# EAGLE design skithSTMv2 (EAGLE 6.6.0)

## Sheet 1 of 2
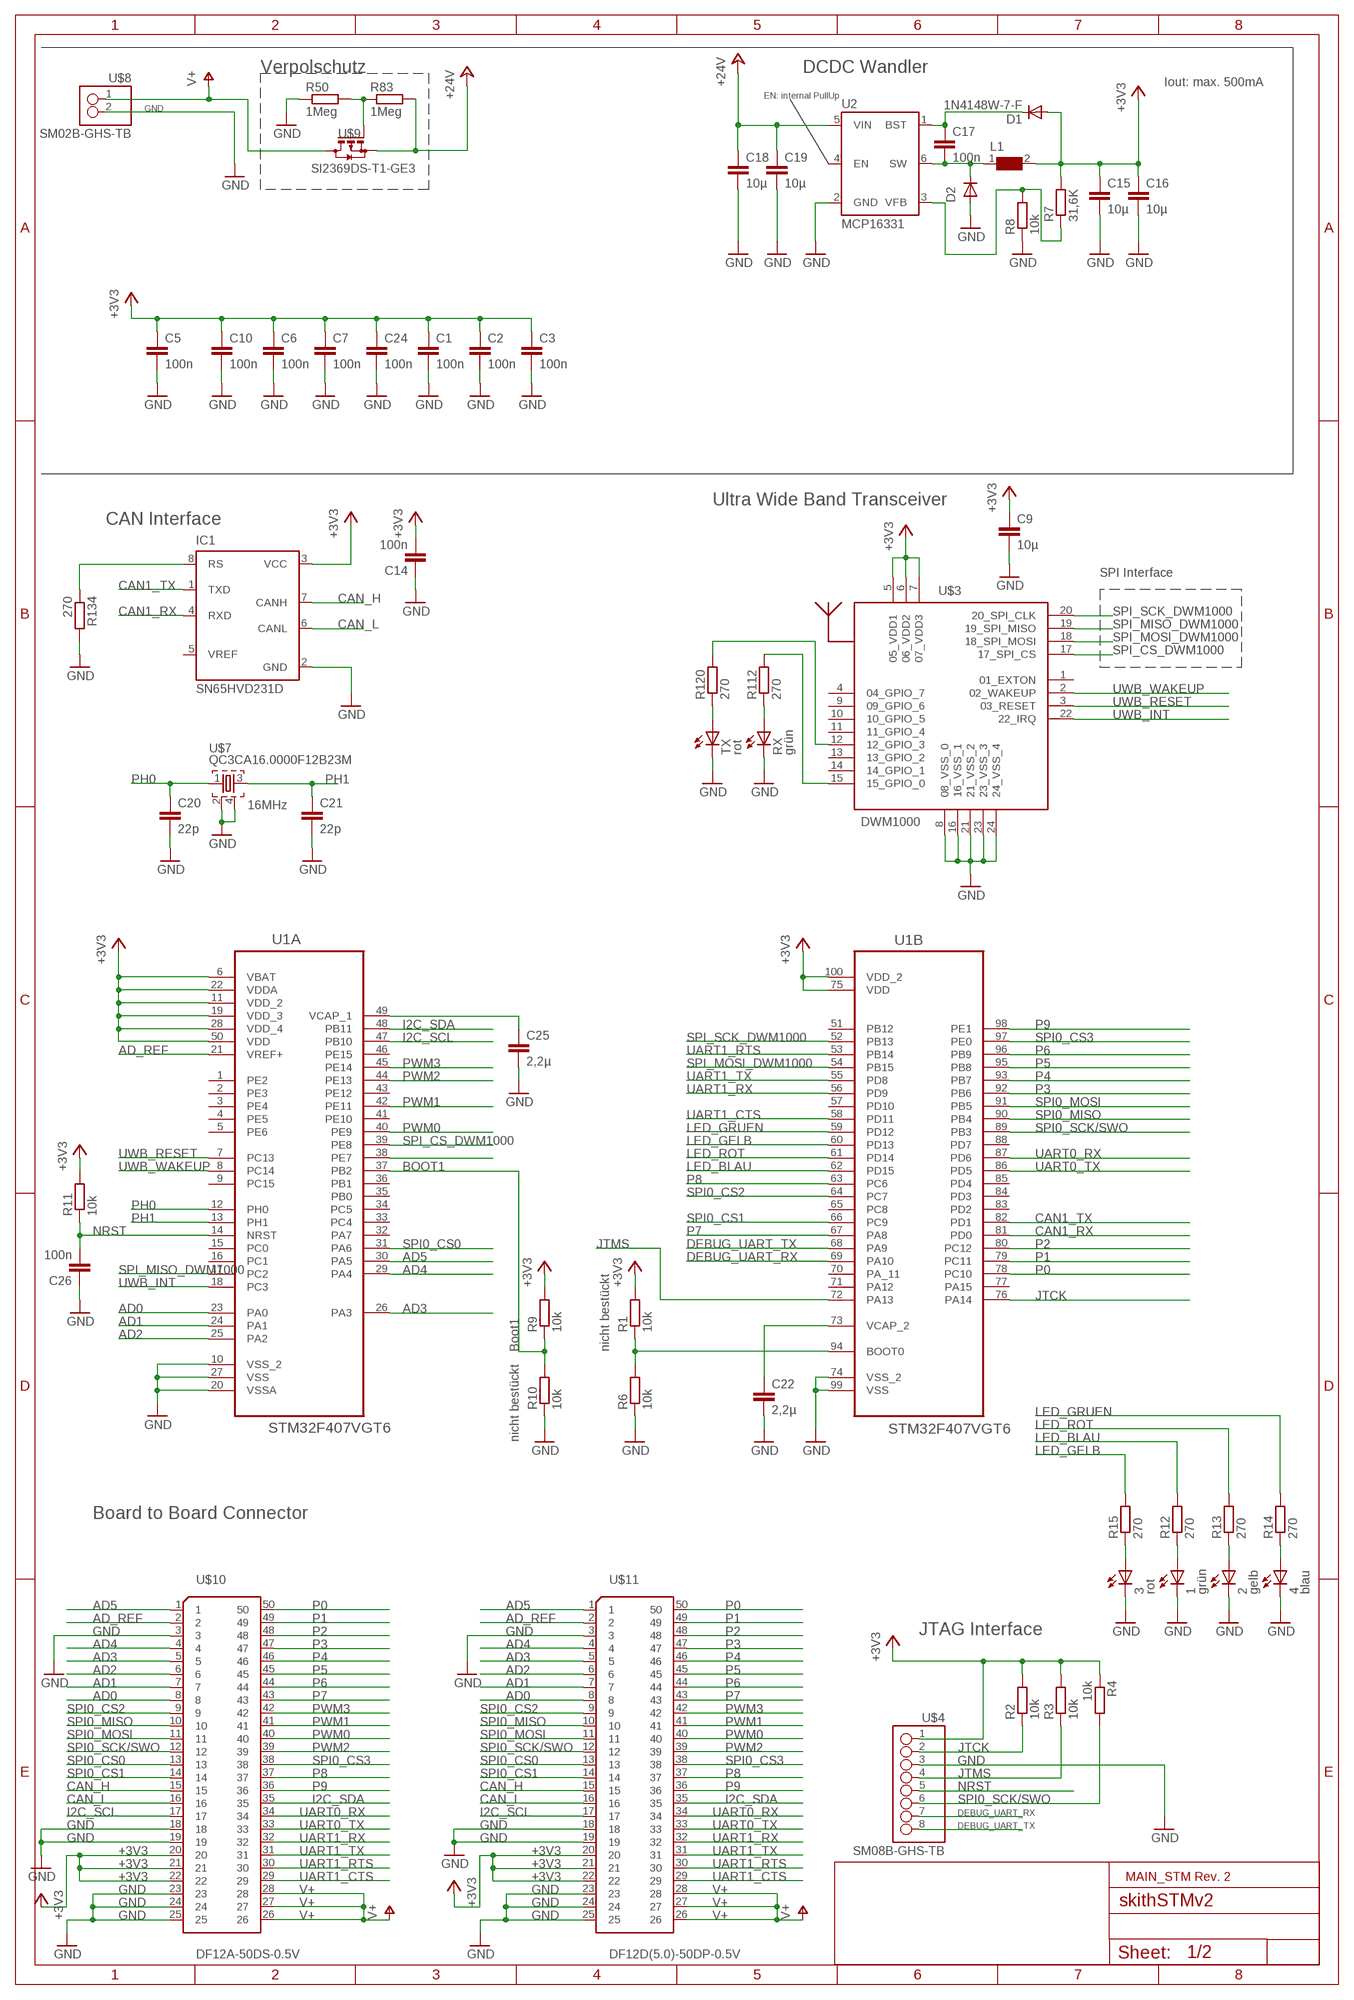
[diagram p0: schematic, sheet 1]

### Parts
1  grün  LEDSML0603  [SML0603]
2  gelb  LEDSML0603  [SML0603]
3  rot  LEDSML0603  [SML0603]
4  blau  LEDSML0603  [SML0603]
C1  100n  C-EUC0402  [C0402]
C2  100n  C-EUC0402  [C0402]
C3  100n  C-EUC0402  [C0402]
C5  100n  C-EUC0402  [C0402]
C6  100n  C-EUC0402  [C0402]
C7  100n  C-EUC0402  [C0402]
C9  10µ  C-EUC0805  [C0805]
C10  100n  C-EUC0402  [C0402]
C14  100n  C-EUC0402  [C0402]
C15  10µ  C-EUC0805  [C0805]
C16  10µ  C-EUC0805  [C0805]
C17  100n  C-EUC0402  [C0402]
C18  10µ  C-EUC0805  [C0805]
C19  10µ  C-EUC0805  [C0805]
C20  22p  C-EUC0402  [C0402]
C21  22p  C-EUC0402  [C0402]
C22  2,2µ  C-EUC0402  [C0402]
C24  100n  C-EUC0402  [C0402]
C25  2,2µ  C-EUC0402  [C0402]
C26  100n  C-EUC0402  [C0402]
D1  1N4148W-7-F  DIODE-SOD123  [SOD123]
D2  DIODE-DO214AC  [DO214AC]
IC1  SN65HVD231D  PCA82C250T  [SO8]
L1  WE-TPC-744025150_2828  [WE-TPC_2828]
R1  10k  R-EU_R0402  [R0402]
R2  10k  R-EU_R0402  [R0402]
R3  10k  R-EU_R0402  [R0402]
R4  10k  R-EU_R0402  [R0402]
R6  10k  R-EU_R0402  [R0402]
R7  31,6K  R-EU_R0402  [R0402]
R8  10k  R-EU_R0402  [R0402]
R9  10k  R-EU_R0402  [R0402]
R10  10k  R-EU_R0402  [R0402]
R11  10k  R-EU_R0402  [R0402]
R12  270  R-EU_R0402  [R0402]
R13  270  R-EU_R0402  [R0402]
R14  270  R-EU_R0402  [R0402]
R15  270  R-EU_R0402  [R0402]
R50  1Meg  R-EU_R0402  [R0402]
R83  1Meg  R-EU_R0402  [R0402]
R112  270  R-EU_R0402  [R0402]
R120  270  R-EU_R0402  [R0402]
R134  270  R-EU_R0402  [R0402]
RX  grün  LEDSML0603  [SML0603]
TX  rot  LEDSML0603  [SML0603]
U1  STM32F407VGT6  [QFP50P1600X1600X160-100N]
U2  MCP16331  [SOT23-6]
U$3  DWM1000  [DWM1000]
U$4  SM08B-GHS-TB  [SM08B-GHS-TB]
U$7  QC3CA16.0000F12B23M  QC3CA12.0000F12B23M  [LFXTAL055998]
U$8  SM02B-GHS-TB  [SM02B-GHS-TB]
U$9  SI2369DS-T1-GE3  [SOT23]
U$10  DF12A-50DS-0.5V  [DF12A-50DS-0.5V]
U$11  DF12D(5.0)-50DP-0.5V  [DF12D(5.0)-50DP-0.5V]

### Nets
+3V3: C1.1 C2.1 C3.1 C5.1 C6.1 C7.1 C9.1 C10.1 C14.2 C15.1 C16.1 C24.1 D1.A IC1.3(VCC) L1.2 R1.2 R2.2 R3.2 R4.1 R7.2 R9.2 R11.2 U1.6(A:VBAT) U1.11(A:VDD_2) U1.19(A:VDD_3) U1.22(A:VDDA) U1.28(A:VDD_4) U1.50(A:VDD) U1.75(B:VDD) U1.100(B:VDD_2) U$3.5(05_VDD1) U$3.6(06_VDD2) U$3.7(07_VDD3) U$4.1 U$10.20 U$10.21 U$10.22 U$11.20 U$11.21 U$11.22
+24V: C18.1 C19.1 R83.2 U2.5(VIN) U$9.2(S)
AD0: U1.23(A:PA0) U$10.8 U$11.8
AD1: U1.24(A:PA1) U$10.7 U$11.7
AD2: U1.25(A:PA2) U$10.6 U$11.6
AD3: U1.26(A:PA3) U$10.5 U$11.5
AD4: U1.29(A:PA4) U$10.4 U$11.4
AD5: U1.30(A:PA5) U$10.1 U$11.1
AD_REF: U1.21(A:VREF+) U$10.2 U$11.2
BOOT1: R9.1 R10.2 U1.37(A:PB2)
CAN1_RX: IC1.4(RXD) U1.81(B:PD0)
CAN1_TX: IC1.1(TXD) U1.82(B:PD1)
CAN_H: IC1.7(CANH) U$10.15 U$11.15
CAN_L: IC1.6(CANL) U$10.16 U$11.16
DEBUG_UART_RX: U1.69(B:PA10) U$4.7
DEBUG_UART_TX: U1.68(B:PA9) U$4.8
GND: 1.C 2.C 3.C 4.C C1.2 C2.2 C3.2 C5.2 C6.2 C7.2 C9.2 C10.2 C14.1 C15.2 C16.2 C18.2 C19.2 C20.2 C21.2 C22.2 C24.2 C25.2 C26.1 D2.A IC1.2(GND) R6.1 R8.1 R10.1 R50.1 R134.2 RX.C TX.C U1.10(A:VSS_2) U1.20(A:VSSA) U1.27(A:VSS) U1.74(B:VSS_2) U1.99(B:VSS) U2.2(GND) U$3.8(08_VSS_0) U$3.16(16_VSS_1) U$3.21(21_VSS_2) U$3.23(23_VSS_3) U$3.24(24_VSS_4) U$4.3 U$7.2 U$7.4 U$8.2 U$10.3 U$10.18 U$10.19 U$10.23 U$10.24 U$10.25 U$11.3 U$11.18 U$11.19 U$11.23 U$11.24 U$11.25
I2C_SCL: U1.47(A:PB10) U$10.17 U$11.17
I2C_SDA: U1.48(A:PB11) U$10.35 U$11.35
JTCK: R2.1 U1.76(B:PA14) U$4.2
JTMS: R3.1 U1.72(B:PA13) U$4.4
LED_BLAU: R12.2 U1.62(B:PD15)
LED_GELB: R15.2 U1.60(B:PD13)
LED_GRUEN: R14.2 U1.59(B:PD12)
LED_ROT: R13.2 U1.61(B:PD14)
N$1: C22.1 U1.73(B:VCAP_2)
N$2: R112.2 U$3.15(15_GPIO_0)
N$3: U1.38(A:PE7)
N$5: R7.1 R8.2 U2.3(VFB)
N$7: C17.1 D1.C U2.1(BST)
N$8: C17.2 D2.C L1.1 U2.6(SW)
N$9: 1.A R12.1
N$11: 2.A R13.1
N$13: 4.A R14.1
N$14: R1.1 R6.2 U1.94(B:BOOT0)
N$15: 3.A R15.1
N$40: C25.1 U1.49(A:VCAP_1)
N$46: IC1.8(RS) R134.1
N$80: R112.1 RX.A
N$89: R120.1 TX.A
N$94: R120.2 U$3.12(12_GPIO_3)
N$97: R50.2 R83.1 U$9.1(G)
NRST: C26.2 R11.1 U1.14(A:NRST) U$4.5
P0: U1.78(B:PC10) U$10.50 U$11.50
P1: U1.79(B:PC11) U$10.49 U$11.49
P2: U1.80(B:PC12) U$10.48 U$11.48
P3: U1.92(B:PB6) U$10.47 U$11.47
P4: U1.93(B:PB7) U$10.46 U$11.46
P5: U1.95(B:PB8) U$10.45 U$11.45
P6: U1.96(B:PB9) U$10.44 U$11.44
P7: U1.67(B:PA8) U$10.43 U$11.43
P8: U1.63(B:PC6) U$10.37 U$11.37
P9: U1.98(B:PE1) U$10.36 U$11.36
PH0: C20.1 U1.12(A:PH0) U$7.1
PH1: C21.1 U1.13(A:PH1) U$7.3
PWM0: U1.40(A:PE9) U$10.40 U$11.40
PWM1: U1.42(A:PE11) U$10.41 U$11.41
PWM2: U1.44(A:PE13) U$10.39 U$11.39
PWM3: U1.45(A:PE14) U$10.42 U$11.42
SPI0_CS0: U1.31(A:PA6) U$10.13 U$11.13
SPI0_CS1: U1.66(B:PC9) U$10.14 U$11.14
SPI0_CS2: U1.64(B:PC7) U$10.9 U$11.9
SPI0_CS3: U1.97(B:PE0) U$10.38 U$11.38
SPI0_MISO: U1.90(B:PB4) U$10.10 U$11.10
SPI0_MOSI: U1.91(B:PB5) U$10.11 U$11.11
SPI0_SCK/SWO: R4.2 U1.89(B:PB3) U$4.6 U$10.12 U$11.12
SPI_CS_DWM1000: U1.39(A:PE8) U$3.17(17_SPI_CS)
SPI_MISO_DWM1000: U1.17(A:PC2) U$3.19(19_SPI_MISO)
SPI_MOSI_DWM1000: U1.54(B:PB15) U$3.18(18_SPI_MOSI)
SPI_SCK_DWM1000: U1.52(B:PB13) U$3.20(20_SPI_CLK)
UART0_RX: U1.87(B:PD6) U$10.34 U$11.34
UART0_TX: U1.86(B:PD5) U$10.33 U$11.33
UART1_CTS: U1.58(B:PD11) U$10.29 U$11.29
UART1_RTS: U1.53(B:PB14) U$10.30 U$11.30
UART1_RX: U1.56(B:PD9) U$10.32 U$11.32
UART1_TX: U1.55(B:PD8) U$10.31 U$11.31
UWB_INT: U1.18(A:PC3) U$3.22(22_IRQ)
UWB_RESET: U1.7(A:PC13) U$3.3(03_RESET)
UWB_WAKEUP: U1.8(A:PC14) U$3.2(02_WAKEUP)
V+: U$8.1 U$9.3(D) U$10.26 U$10.27 U$10.28 U$11.26 U$11.27 U$11.28
Unconnected: IC1.5(VREF) U1.1(A:PE2) U1.2(A:PE3) U1.3(A:PE4) U1.4(A:PE5) U1.5(A:PE6) U1.9(A:PC15) U1.15(A:PC0) U1.16(A:PC1) U1.32(A:PA7) U1.33(A:PC4) U1.34(A:PC5) U1.35(A:PB0) U1.36(A:PB1) U1.41(A:PE10) U1.43(A:PE12) U1.46(A:PE15) U1.51(B:PB12) U1.57(B:PD10) U1.65(B:PC8) U1.70(B:PA_11) U1.71(B:PA12) U1.77(B:PA15) U1.83(B:PD2) U1.84(B:PD3) U1.85(B:PD4) U1.88(B:PD7) U2.4(EN) U$3.1(01_EXTON) U$3.4(04_GPIO_7) U$3.9(09_GPIO_6) U$3.10(10_GPIO_5) U$3.11(11_GPIO_4) U$3.13(13_GPIO_2) U$3.14(14_GPIO_1)

### Notes on the sheet
- Verpolschutz | DCDC Wandler
- Iout: max. 500mA
- EN: internal PullUp
- Ultra Wide Band Transceiver
- CAN Interface
- SPI Interface
- 16MHz
- Boot1 | nicht bestückt
- nicht bestückt
- Board to Board Connector
- JTAG Interface
- MAIN_STM Rev. 2

## Sheet 2 of 2
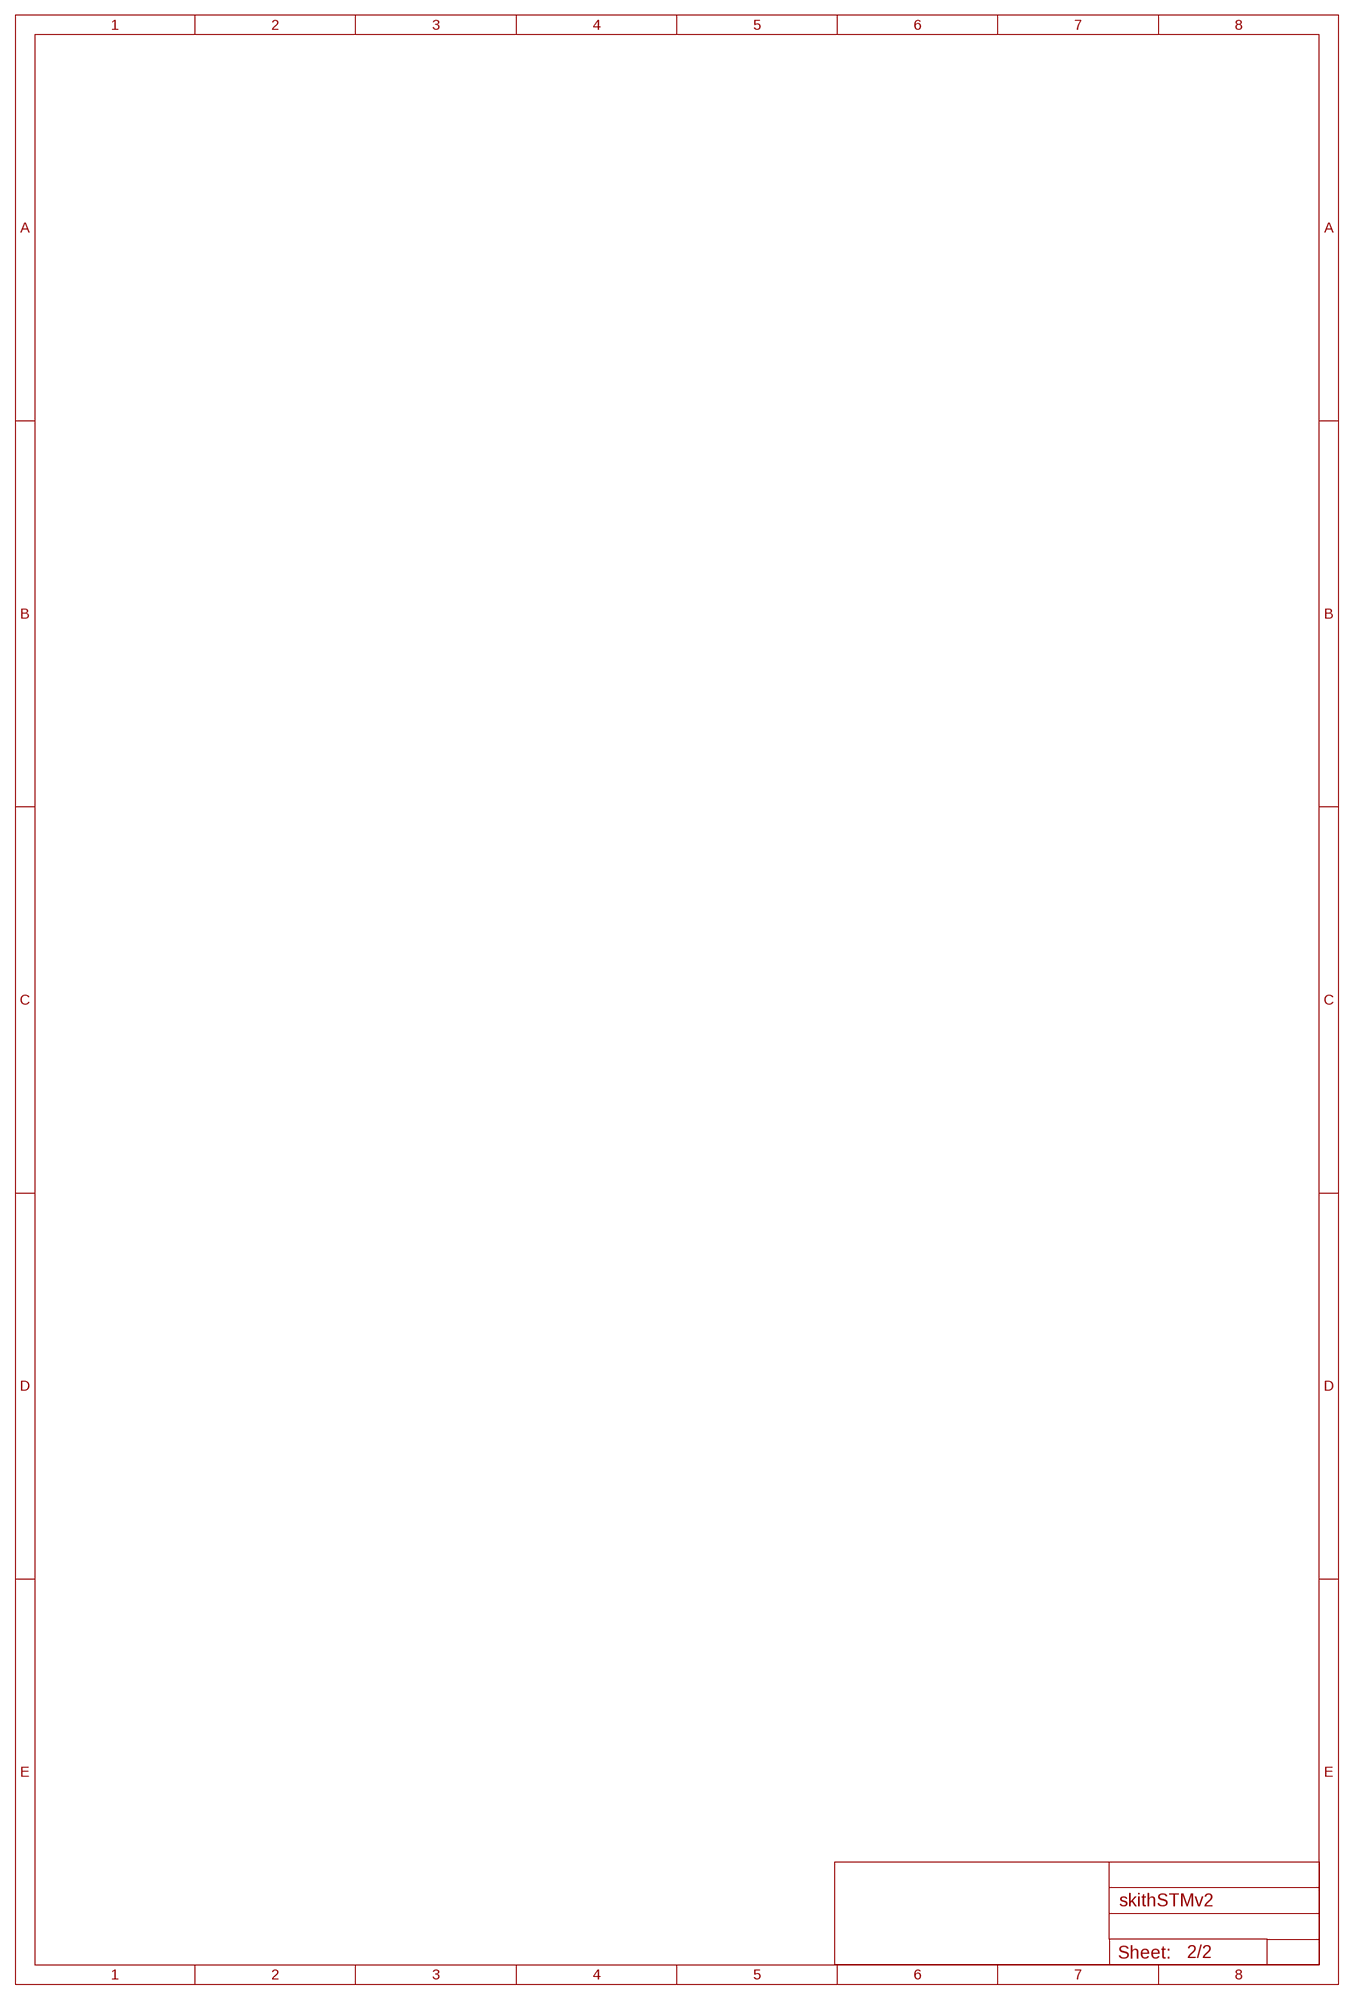
[diagram p1: schematic, sheet 2]

## Library data of the parts
1-4 RX TX = led:LED: LED OSRAM: - CHIPLED LG R971, LG N971, LY N971, LG Q971, LY Q971, LO R971, LY R971 LH N974, LH R974 LS Q976, LO Q976, LY Q976 LO Q996 - Hyper CHIPLED LW Q18S LB Q993, LB Q99A, LB R99A - SideLED LS A670, LO A670, LY A670, LG A670, LP A670 LB A673, LV A673, LT A673, LW A673 LH A674 LY A675 LS A676, LA A676, LO A676, LY A676, LW A676 LS A679, LY A679, LG A679 - Hyper Micro SIDELED® LS Y876, LA Y876, LO Y876, LY Y876 LT Y87S - SmartLED LW L88C, LW L88S LB L89C, LB L89S, LG L890 LS L89K, LO L89K, LY L89K LS L896, LA L896, LO L896, LY L896 - TOPLED LS T670, LO T670, LY T670, LG T670, LP T670 LSG T670, LSP T670, LSY T670, LOP T670, LYG T670 LG T671, LOG T671, LSG T671 LB T673, LV T673, LT T673, LW T673 LH T674 LS T676, LA T676, LO T676, LY T676, LB T676, LH T676, LSB T676, LW T676 LB T67C, LV T67C, LT T67C, LS T67K, LO T67K, LY T67K, LW E67C LS E67B, LA E67B, LO E67B, LY E67B, LB E67C, LV E67C, LT E67C LW T67C LS T679, LY T679, LG T679 LS T770, LO T770, LY T770, LG T770, LP T770 LB T773, LV T773, LT T773, LW T773 LH T774 LS E675, LA E675, LY E675, LS T675 LS T776, LA T776, LO T776, LY T776, LB T776 LHGB T686 LT T68C, LB T68C - Hyper Mini TOPLED® LB M676 - Mini TOPLED Santana® LG M470 LS M47K, LO M47K, LY M47K Source: http://www.osram.convergy.de LUXEON: - LUMILED® LXK2-PW12-R00, LXK2-PW12-S00, LXK2-PW14-U00, LXK2-PW14-V00 LXK2-PM12-R00, LXK2-PM12-S00, LXK2-PM14-U00 LXK2-PE12-Q00, LXK2-PE12-R00, LXK2-PE12-S00, LXK2-PE14-T00, LXK2-PE14-U00 LXK2-PB12-K00, LXK2-PB12-L00, LXK2-PB12-M00, LXK2-PB14-N00, LXK2-PB14-P00, LXK2-PB14-Q00 LXK2-PR12-L00, LXK2-PR12-M00, LXK2-PR14-Q00, LXK2-PR14-R00 LXK2-PD12-Q00, LXK2-PD12-R00, LXK2-PD12-S00 LXK2-PH12-R00, LXK2-PH12-S00 LXK2-PL12-P00, LXK2-PL12-Q00, LXK2-PL12-R00 Source: www.luxeon.com KINGBRIGHT: KA-3528ASYC Source: www.kingbright.com
C1-C3 C5-C7 C9 C10 C14-C22 C24-C26 = rcl:C-EU: CAPACITOR, European symbol
D1 D2 = diode:DIODE-: DIODE
IC1 = micro-philips:PCA82C250: CAN CONTROLLER INTERFACE; OC_FARNELL: 1085275; OC_NEWARK: unknown
L1 = WE-TPC:WE-TPC: Shielded Tiny Power Inductor WE-TPC - Extremely flat power inductor - High current capability - High reliability and perfect soldering characteristics because of integrated soldering pad - magnetically shielded -- Portable power like PDA, digital camera, PCMICA-cards and displays -- DC/DC-converter -- Recommended for switching regulator IC's from Linear Technology, National Semiconductor, Texas Instruments and Fairchild Semiconductor; MPN: 744025150; OC_FARNELL: 1869746; OC_NEWARK: 32T8558; PACKAGE: 2828; SUPPLIER: WURTH ELEKTRONIK
R1-R4 R6-R15 R50 R83 R112 R120 R134 = rcl:R-EU_: RESISTOR, European symbol
U1 = STM32F4:STM32F407VGT6: IC, MCU, 32BIT, 1MB FLASH, 100LQFP; MPN: STM32F407VGT6; OC_FARNELL: 2064368; OC_NEWARK: 73T2333; PACKAGE: 100LQFP; SUPPLIER: STMicroelectronics
U2 = skith:MCP16331: MCP16331 Step Down Regulator Vin 4.4V - 50V Vout 2.0V - 24V Iout 500mA; OC_FARNELL: 2448515
U$3 = skith:DWM1000: UWB Transceiver; OC_DIGIKEY: 1479-1002-1-ND
U$4 = con-jst-sh:SM08B-GHS-TB; OC_DIGIKEY: 455-1570-1-ND
U$7 = skith:QC3CA12.0000F12B23M: 12MHz Quarz; OC_FARNELL: 2508630
U$8 = con-jst-sh:SM02B-GHS-TB; OC_DIGIKEY: 455-1564-1-ND
U$9 = skith:SI2369DS-T1-GE3: Hersteller: VISHAY Herstellerteilenummer: SI2369DS-T1-GE3 Farnell Bestellnummer: 2400360 Wandlerpolarität: p-Kanal Dauer-Drainstrom Id: -7.6A Drain-Source-Spannung Vds: -30V Betriebswiderstand, Rds(on): 0.024ohm Rds(on)-Messspannung Vgs: -10V Schwellenspannung Vgs: - Verlustleistung Pd: 2.5W; OC_FARNELL: 2400360
U$10 = skith:DF12A-50DS-0.5V: with fitting; OC_FARNELL: 2300323
U$11 = skith:DF12D(5.0)-50DP-0.5V: with fitting; OC_FARNELL: 2300334

## Net classes
0 default: width 0.152 mm, drill 0.127 mm, clearance 0.152 mm

## Board
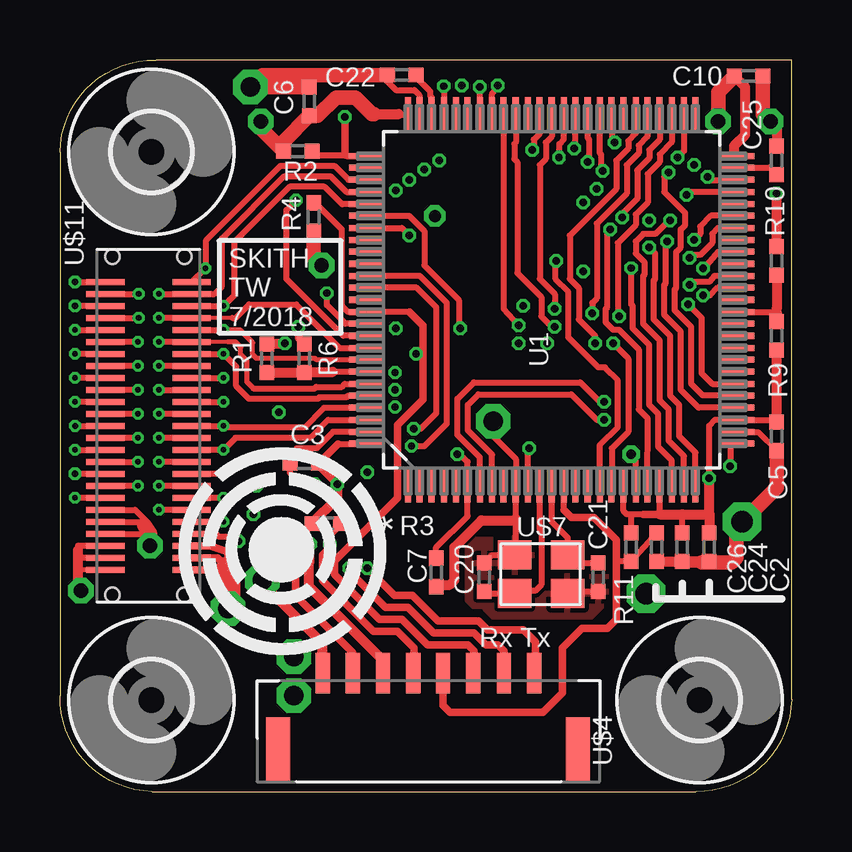
[diagram p2: board, top side]
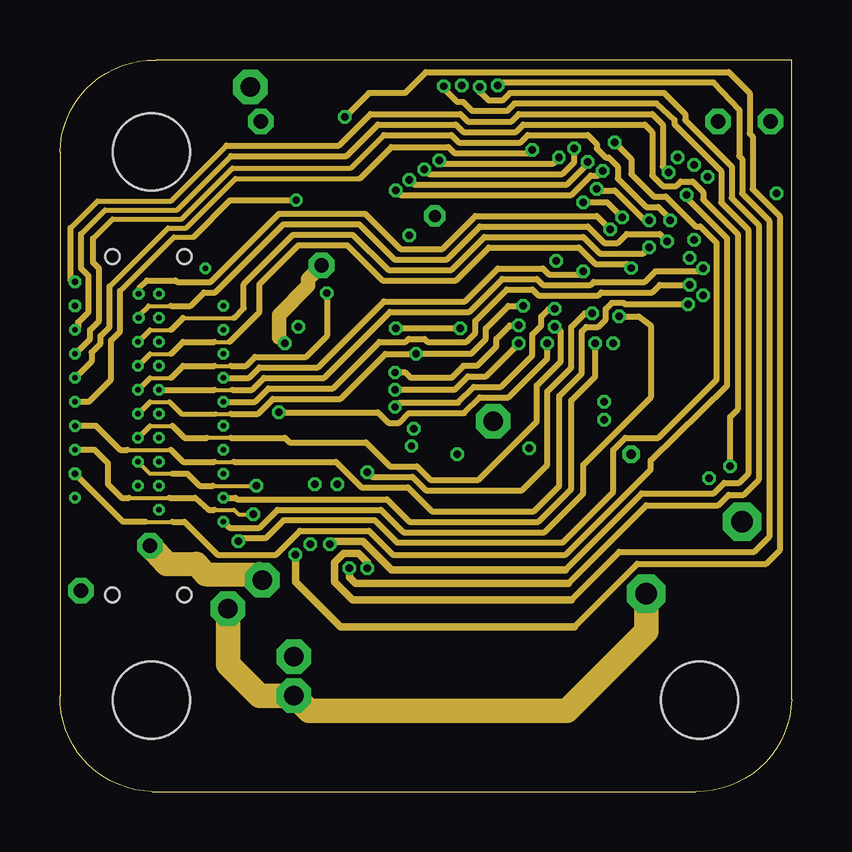
[diagram p3: board, inner layer Route2]
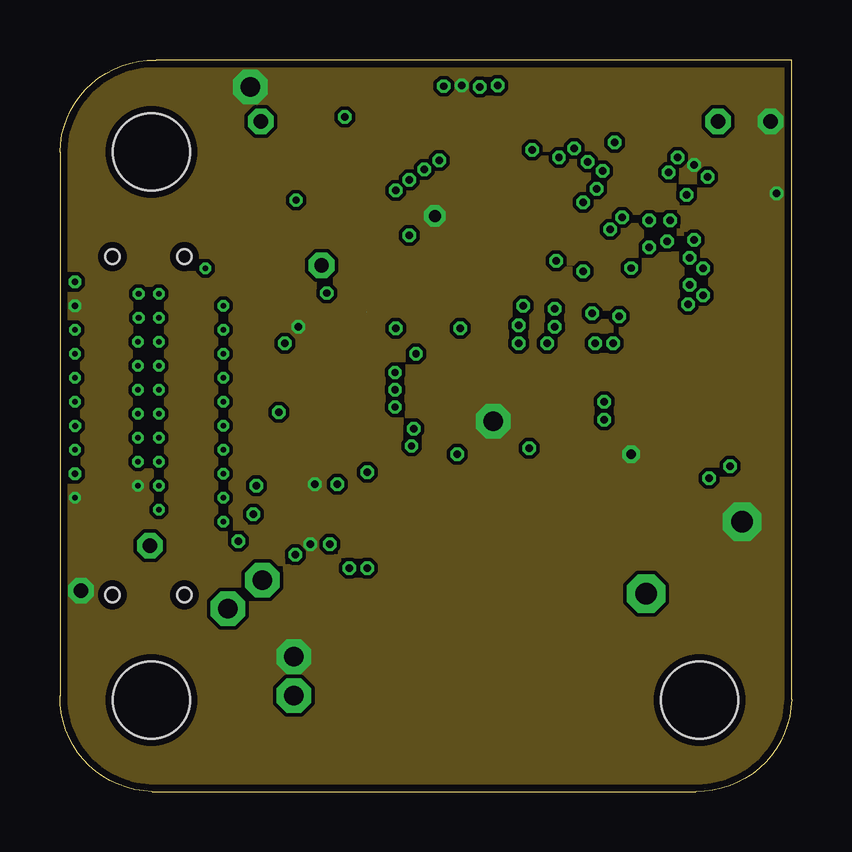
[diagram p4: board, inner layer Route15]
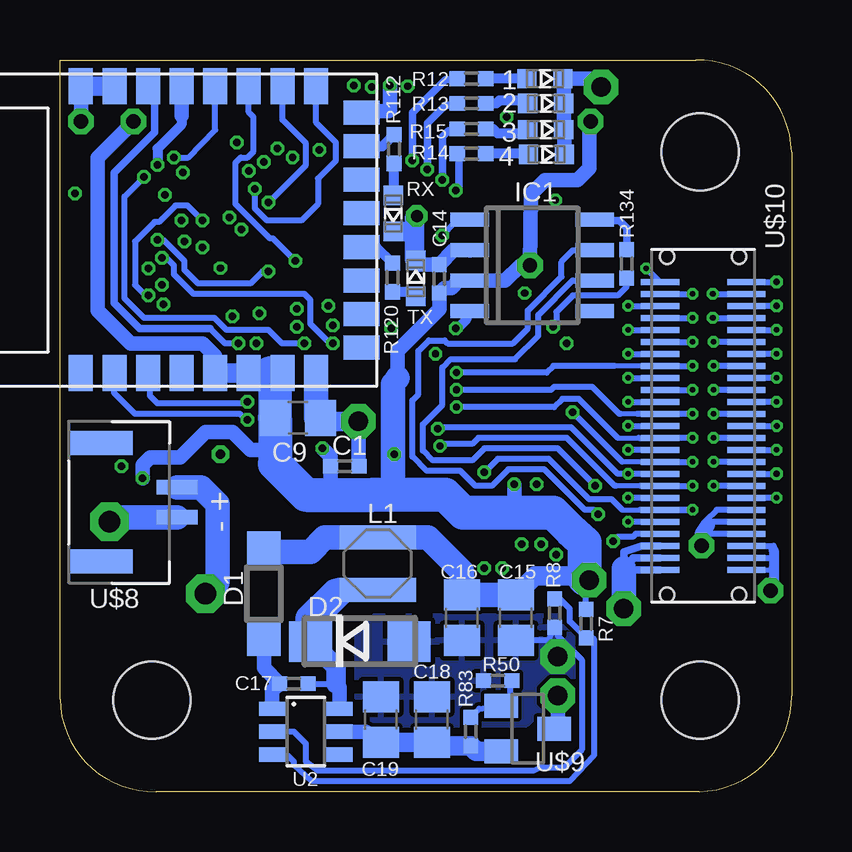
[diagram p5: board, bottom side, seen from below]

Size 30.5 x 30.5 mm. Coordinates in mm from the lower left corner, seen from the top.
Outline: 3.84,0 26.5,0 arc90 30.5,3.84 30.5,30.5 4,30.5 arc90 0,26.66 0,4 arc90 3.84,0
Copper layers (1+2*15+16): Top 0.035mm / dielectric 0.38mm / Route2 0.035mm / dielectric 0.71mm / Route15 0.035mm / dielectric 0.38mm / Bottom 0.035mm
Design rules "PCB-POOL HighSpec_ML4 *": minimum track width 0.125mm, minimum drill 0.2mm, track to track 0.125mm, track to pad 0.125mm, pad to pad 0.125mm, via to via 0.125mm, smd to smd 0.125mm, copper to edge 0.3mm, drill to drill 0.2mm, minimum pad ring 0.2mm, minimum via ring 0.125mm, stop-mask expansion 0.075mm, vias tented up to drill 1mm, thermal gap 0.2mm
tRestrict: 12 lines
bRestrict: 11 lines

### Footprints (pad centres in the part's own frame; a part is rotated, then mirrored left to right if it is on the bottom)
SML0603 = smd 0.8 x 0.8: A 0.75,0; C -0.75,0
C0402 = smd 0.635 x 0.61: 1 -0.597,0; 2 0.597,0
C0805 = smd 1.3 x 1.5: 1 -0.95,0; 2 0.95,0
SOD123 = smd 1.4 x 1.4: A 1.9,0; C -1.9,0
DO214AC = smd 1.8 x 1.7: A 2.05,0; C -2.05,0
SO8 = smd 0.6 x 1.6: 1 -1.905,-2.6; 2 -0.635,-2.6; 3 0.635,-2.6; 4 1.905,-2.6; 5 1.905,2.6; 6 0.635,2.6; 7 -0.635,2.6; 8 -1.905,2.6
WE-TPC_2828 = smd 3.2 x 1: 1 0,1.1; 2 0,-1.1
R0402 = smd 0.635 x 0.61: 1 -0.597,0; 2 0.597,0
QFP50P1600X1600X160-100N = smd 1.473 x 0.254: 1 -7.722,5.994; 2 -7.722,5.512; 3 -7.722,5.004; 4 -7.722,4.496; 5 -7.722,3.988; 6 -7.722,3.505; 7 -7.722,2.997; 8 -7.722,2.489; 9 -7.722,2.007; 10 -7.722,1.499; 11 -7.722,0.991; 12 -7.722,0.508; 13 -7.722,0; 14 -7.722,-0.508; 15 -7.722,-0.991; 16 -7.722,-1.499; 17 -7.722,-2.007; 18 -7.722,-2.489; 19 -7.722,-2.997; 20 -7.722,-3.505; 21 -7.722,-3.988; 22 -7.722,-4.496; 23 -7.722,-5.004; 24 -7.722,-5.512; 25 -7.722,-5.994; 51 7.722,-5.994; 52 7.722,-5.512; 53 7.722,-5.004; 54 7.722,-4.496; 55 7.722,-3.988; 56 7.722,-3.505; 57 7.722,-2.997; 58 7.722,-2.489; 59 7.722,-2.007; 60 7.722,-1.499; 61 7.722,-0.991; 62 7.722,-0.508; 63 7.722,0; 64 7.722,0.508; 65 7.722,0.991; 66 7.722,1.499; 67 7.722,2.007; 68 7.722,2.489; 69 7.722,2.997; 70 7.722,3.505; 71 7.722,3.988; 72 7.722,4.496; 73 7.722,5.004; 74 7.722,5.512; 75 7.722,5.994 | smd 0.254 x 1.473: 26 -5.994,-7.722; 27 -5.512,-7.722; 28 -5.004,-7.722; 29 -4.496,-7.722; 30 -3.988,-7.722; 31 -3.505,-7.722; 32 -2.997,-7.722; 33 -2.489,-7.722; 34 -2.007,-7.722; 35 -1.499,-7.722; 36 -0.991,-7.722; 37 -0.508,-7.722; 38 0,-7.722; 39 0.508,-7.722; 40 0.991,-7.722; 41 1.499,-7.722; 42 2.007,-7.722; 43 2.489,-7.722; 44 2.997,-7.722; 45 3.505,-7.722; 46 3.988,-7.722; 47 4.496,-7.722; 48 5.004,-7.722; 49 5.512,-7.722; 50 5.994,-7.722; 76 5.994,7.722; 77 5.512,7.722; 78 5.004,7.722; 79 4.496,7.722; 80 3.988,7.722; 81 3.505,7.722; 82 2.997,7.722; 83 2.489,7.722; 84 2.007,7.722; 85 1.499,7.722; 86 0.991,7.722; 87 0.508,7.722; 88 0,7.722; 89 -0.508,7.722; 90 -0.991,7.722; 91 -1.499,7.722; 92 -2.007,7.722; 93 -2.489,7.722; 94 -2.997,7.722; 95 -3.505,7.722; 96 -3.988,7.722; 97 -4.496,7.722; 98 -5.004,7.722; 99 -5.512,7.722; 100 -5.994,7.722
SOT23-6 = smd 0.6 x 1.1: 1 -0.95,-1.4; 2 0,-1.4; 3 0.95,-1.4; 4 0.95,1.4; 5 0,1.4; 6 -0.95,1.4
3,2 = hole 3.2: 0,0
DWM1000 = smd 1.5 x 1: 1 -5.95,3.722; 2 -5.95,2.322; 3 -5.95,0.922; 4 -5.95,-0.478; 5 -5.95,-1.878; 6 -5.95,-3.278; 7 -5.95,-4.678; 8 -5.95,-6.078; 17 6.005,-6.078; 18 6.005,-4.678; 19 6.005,-3.278; 20 6.005,-1.878; 21 6.005,-0.478; 22 6.005,0.922; 23 6.005,2.322; 24 6.005,3.722 | smd 1 x 1.5: 9 -4.9,-7.98; 10 -3.5,-7.98; 11 -2.1,-7.98; 12 -0.7,-7.98; 13 0.7,-7.98; 14 2.1,-7.98; 15 3.5,-7.98; 16 4.9,-7.98
SM08B-GHS-TB = smd 0.6 x 1.7: 1 -4.425,2.565; 2 -3.175,2.565; 3 -1.905,2.565; 4 -0.645,2.565; 5 0.595,2.565; 6 1.855,2.565; 7 3.135,2.565; 8 4.395,2.565 | smd 1 x 2.7: P-MOUNT1 -6.275,-0.635; P-MOUNT2 6.215,-0.635
LFXTAL055998 = smd 1.4 x 1.2: 1 1.1,0.8; 2 -1.1,0.8; 3 -1.1,-0.8; 4 1.1,-0.8
SM02B-GHS-TB = smd 0.6 x 1.7: 1 0,3.2; 2 1.25,3.2 | smd 1 x 2.7: P-MOUNT1 -1.85,0; P-MOUNT2 3.1,0
SOT23 = smd 1 x 1.4: 1 -0.95,-1.1; 2 0.95,-1.1; 3 0,1.1
DF12A-50DS-0.5V = smd 1.6 x 0.25: 1 1.8,6; 2 1.8,5.5; 3 1.8,5; 4 1.8,4.5; 5 1.8,4; 6 1.8,3.5; 7 1.8,3; 8 1.8,2.5; 9 1.8,2; 10 1.8,1.5; 11 1.8,1; 12 1.8,0.5; 13 1.8,0; 14 1.8,-0.5; 15 1.8,-1; 16 1.8,-1.5; 17 1.8,-2; 18 1.8,-2.5; 19 1.8,-3; 20 1.8,-3.5; 21 1.8,-4; 22 1.8,-4.5; 23 1.8,-5; 24 1.8,-5.5; 25 1.8,-6; 26 -1.8,-6; 27 -1.8,-5.5; 28 -1.8,-5; 29 -1.8,-4.5; 30 -1.8,-4; 31 -1.8,-3.5; 32 -1.8,-3; 33 -1.8,-2.5; 34 -1.8,-2; 35 -1.8,-1.5; 36 -1.8,-1; 37 -1.8,-0.5; 38 -1.8,0; 39 -1.8,0.5; 40 -1.8,1; 41 -1.8,1.5; 42 -1.8,2; 43 -1.8,2.5; 44 -1.8,3; 45 -1.8,3.5; 46 -1.8,4; 47 -1.8,4.5; 48 -1.8,5; 49 -1.8,5.5; 50 -1.8,6 | hole 0.6: 1.5,7.05; 1.5,-7.05
DF12D(5.0)-50DP-0.5V = smd 1.6 x 0.25: 1 -1.8,6; 2 -1.8,5.5; 3 -1.8,5; 4 -1.8,4.5; 5 -1.8,4; 6 -1.8,3.5; 7 -1.8,3; 8 -1.8,2.5; 9 -1.8,2; 10 -1.8,1.5; 11 -1.8,1; 12 -1.8,0.5; 13 -1.8,0; 14 -1.8,-0.5; 15 -1.8,-1; 16 -1.8,-1.5; 17 -1.8,-2; 18 -1.8,-2.5; 19 -1.8,-3; 20 -1.8,-3.5; 21 -1.8,-4; 22 -1.8,-4.5; 23 -1.8,-5; 24 -1.8,-5.5; 25 -1.8,-6; 26 1.8,-6; 27 1.8,-5.5; 28 1.8,-5; 29 1.8,-4.5; 30 1.8,-4; 31 1.8,-3.5; 32 1.8,-3; 33 1.8,-2.5; 34 1.8,-2; 35 1.8,-1.5; 36 1.8,-1; 37 1.8,-0.5; 38 1.8,0; 39 1.8,0.5; 40 1.8,1; 41 1.8,1.5; 42 1.8,2; 43 1.8,2.5; 44 1.8,3; 45 1.8,3.5; 46 1.8,4; 47 1.8,4.5; 48 1.8,5; 49 1.8,5.5; 50 1.8,6 | hole 0.6: 1.5,7.05; 1.5,-7.05

### Placement (x,y rotation side)
1  10.28,29.72 180 bottom
2  10.25,28.69 180 bottom
3  10.25,27.59 180 bottom
4  10.22,26.56 180 bottom
C1  18.62,13.56 0 bottom
C2  27.06,10.19 270 top
C3  10.19,13.69 180 top
C5  29.88,14.81 270 top
C6  10.39,28.77 90 top
C7  15.68,9.14 270 top
C9  20.59,15.58 0 bottom
C10  28.71,29.83 0 top
C14  14.69,21.38 270 bottom
C15  11.5,7.25 270 bottom
C16  13.75,7.25 270 bottom
C17  20.75,4.5 0 bottom
C18  15,3 90 bottom
C19  17.12,3 90 bottom
C20  17.69,8.94 90 top
C21  22.44,8.94 270 top
C22  14.25,29.88 180 top
C24  25.94,10.19 270 top
C25  29.88,26.31 90 top
C26  24.88,10.19 90 top
D1  22,8.25 90 bottom
D2  18,6.25 0 bottom
IC1  10.81,21.94 270 bottom
L1  17.25,9.5 180 bottom
R1  8.62,18.06 90 top
R2  9.91,26.7 180 top
R3  11.12,11.17 180 top
R4  10.58,23.95 90 top
R6  10.19,18.06 270 top
R7  8.56,7 90 bottom
R8  9.88,7.44 90 bottom
R9  29.88,19 270 top
R10  29.88,22.12 270 top
R11  23.81,10.19 90 top
R12  13.34,29.72 180 bottom
R13  13.34,28.69 180 bottom
R14  13.34,26.59 180 bottom
R15  13.34,27.62 180 bottom
R50  12.25,4.62 0 bottom
R83  13.38,2.5 270 bottom
R112  16.57,26.79 90 bottom
R120  16.64,21.43 90 bottom
R134  6.88,22 270 bottom
RX  16.61,24.1 90 bottom
TX  15.66,21.4 270 bottom
U1  20.5,20.5 90 top
U2  20.25,2.5 270 bottom
U$1  [3,2]  3.81,26.67 0 top
U$3  25.91,23.41 90 bottom
U$4  15.38,2.38 0 top
U$5  [3,2]  3.81,3.81 0 top
U$6  [3,2]  26.67,3.81 0 top
U$7  20.06,9.06 180 top
U$8  28.81,12.69 270 bottom
U$9  11,2.62 270 bottom
U$10  3.69,15.25 0 bottom
U$11  3.69,15.25 0 top

### Tracks (layer width: path | path; a pad name or v marks a point on that pad's centre or on a via)
+3V3  (via drill 0.3, 0.6, 0.8)
  Top 0.254: U$10.20 3.12,11.75 3.59,11.28 | 3.59,11.28 3.5,11.12 | U$10.21 3.56,11.25 3.59,11.28 | U$10.22 3.75,10.75 | 11.6,14.5 U1.100 | 28.11,26.61 U1.50 | C5.1 29.88,15.5 U1.28 27.31,15.5 27.06,15.25 v27.06,13.06 | C7.1 15.68,10.18 17,11.5 17,11.51 U1.6 17,13.75 16.68,14.06 v16.56,14.06 | U1.11 19.5,14.25 v19.56,14.31 | 24.31,11.56 23.81,11.56 | 23.81,11.56 23.62,11.56 23.5,11.69 U1.19 | 14.12,28.25 14.1,28.22 U1.75 | 10.78,13.59 C3.1 | R11.2 23.81,11.56 | C24.1 25.94,11.56 | U1.22 25,11.57 25,11.56
  Top 0.305: C3.1 11.6,14.5 | v11.56,12.81 10.78,13.59 | 24.31,11.56 25,11.56 | 27,11.56 arc90 27.06,11.62
  Top 0.406: C5.1 R9.2 | v8.44,8.81 8.44,8.69 10.95,6.17 U$4.1 | v27.06,13.06 27.06,11.62 C2.1 | 13.09,28.25 14.12,28.25 | 25,11.56 25.94,11.56 27,11.56 | 28.11,26.61 28.11,26.92 28.56,27.38 28.56,29.38 C10.1 | R3.2 10.52,11.21 11.56,12.25 v11.56,12.81 | v9.38,18.69 9.34,18.66 8.59,18.66 R1.2
  Top 0.6: 3.5,11.12 3.75,10.75 v3.75,10.25
  Top 0.61: R2.2 | 13.09,28.25 13,28.25 12.31,28.94 11.5,28.94 10.74,28.17 C6.1 9.32,27.1 R2.2 | 10.75,22.06 v10.91,21.94 10.58,22.27 R4.1 | R2.2 8.38,27.64 v8.38,27.94 | v27.44,27.94 27.44,29.16 C10.1
  Route2 0.406: 9.12,18.94 v9.38,18.69
  Route2 0.61: v10.91,21.93 v10.91,21.94 10.34,21.38 10.34,21.09 9.12,19.88 9.12,18.94
  Route2 1: 4.44,9.5 5.69,9.5 6.06,9.06 8.31,9.06 v8.44,8.81
  Route2 1.016: v3.75,10.25 4.44,9.5
  Bottom 0.254: 21.55,10.6 D1.A 22.16,10.31 | 11,8.38 11.18,8.2 C15.1 | 13.64,21.34 IC1.3 12.74,21.3 | R7.2 8.62,8.88 | U$10.20 3.12,11.75 3.59,11.28 | 3.59,11.28 3.5,11.12 | U$10.21 3.56,11.25 3.59,11.28 | U$10.22 3.75,10.75 | 16.62,13.94 16.81,12.38 16.62,12.38
  Bottom 0.305: v16.56,14.06 16.62,14 | 8.62,8.88 8.5,8.88 v8.44,8.81
  Bottom 0.406: 21.38,17.69 U$3.7
  Bottom 0.6: 3.5,11.12 3.75,10.75 v3.75,10.25
  Bottom 0.61: v27.06,13.06 27.06,13.62 26.75,13.94 25.5,13.94 24.44,15 23.31,15 22.56,14.25 21.6,14.25 21.54,14.19 | v8.38,27.94 8.44,27.88 8.44,26 8.94,25.5 10.28,25.5 10.88,24.91 v10.91,21.94 11.31,21.94 11.95,21.3 IC1.3 13.88,21.3 14.19,21 14.47,21 C14.2 14.69,20.12 16.44,18.38 16.44,17.25 | 11.62,11.62 11.56,11.56 v11.56,12.81 | 21.54,13.66 21.69,13.69 21.69,13.44 21.75,13.5 | U$3.5 24.02,18.15 24.56,18.69 27.56,18.69 28.94,20.06 28.94,26.44 v27.44,27.94 | 19.19,12.38 19.22,12.41 C1.1 19.22,13.97 v19.56,14.31
  Bottom 0.813: U$3.7 21.75,17.45 U$3.6 | U$3.6 U$3.5 24,17.48 | C15.1 10.7,9 8.62,9 | U$3.6
  Bottom 1.016: C15.1 C16.1 13.75,9.19 15.16,10.6 L1.2 19.46,10.6 20.06,10 21.85,10 D1.A | 17.44,12.38 17.59,12.47 | 8.62,9 arc90 v8.44,8.81 | 16.44,17.25 16.62,17 16.62,14 16.62,13.94 16.62,12.38
  Bottom 1.4: C9.1 21.54,17.24 21.75,17.45
  Bottom 1.422: C9.1 21.54,14.19 21.54,13.66 20.25,12.38 19.19,12.38 17.44,12.38 16.62,12.38 14.44,12.38 13.69,11.62 11.62,11.62 9.94,11.62 9.25,10.94 8.62,10.38 8.62,8.88
+24V
  Bottom 0.305: 17.3,2.05 17.75,2.5
  Bottom 0.61: 17.75,2.5 U2.5
  Bottom 0.813: U$9.2 13.15,1.68 R83.2 14.85,1.9 C18.1 C19.1 17.3,2.05
AD0  (via drill 0.23, 0.3)
  Top 0.254: v3.25,17.75 U$10.8 | U1.23 25.5,13.81 24.94,14.38 24.94,15.75 24.56,16.12 24.56,18.62 23.88,19.31 23.88,20.25 23.81,20.31 v23.81,21.82
  Route2 0.16: 3.75,18.25 4.62,18.25 | 6.44,18.75 7.06,18.75
  Route2 0.2: v3.25,17.75 3.75,18.25
  Route2 0.254: 4.62,18.25 5.12,18.75 6.44,18.75 | 7.06,18.75 8.31,20 8.31,21.16 9.94,22.78 11.97,22.78 13.44,21.31 16.5,21.31 17.88,22.69 21.62,22.69 22.31,22 23.62,22 v23.81,21.82
  Bottom 0.254: U$10.8 v3.25,17.75
AD1  (via drill 0.23, 0.3)
  Top 0.254: U$10.7 v0.62,18.25 | U1.24 26.01,13.99 25.38,14.62 25.38,15.94 25,16.31 25,18.81 24.31,19.5 24.31,21.5 24.38,21.56 24.38,22.06 24,22.44 24,22.94 24.31,23.25 24.81,23.25 25.38,23.81 v25.44,23.81
  Route2 0.2: 1.38,23.06 2.19,23.88 5.06,23.88 7.19,26 12.12,26 13.5,27.38
  Route2 0.254: v0.62,18.25 1.25,18.88 1.25,19.25 1.62,19.62 1.62,21.81 1.38,22.06 1.38,23.06 | 13.5,27.38 16.31,27.38 16.62,27.06 19.19,27.06 19.5,27.38 22,27.38 22.38,27 22.38,26.81 22.75,26.44 22.88,26.44 23.25,26.06 23.25,25.56 24.44,24.38 24.94,24.38 25.31,24 v25.44,23.81
  Bottom 0.254: v0.62,18.25 U$10.7
AD2  (via drill 0.23, 0.3)
  Top 0.254: v3.25,18.75 U$10.6 | U1.25 26.49,14.13 25.81,14.81 25.81,16.12 25.44,16.5 25.44,19 24.75,19.69 24.75,21.31 24.81,21.38 24.81,22.44 v24.56,22.69
  Route2 0.16: 3.75,19.25 4.62,19.25 | 5.12,19.75 7.25,19.75
  Route2 0.2: v3.25,18.75 3.75,19.25
  Route2 0.254: 4.62,19.25 5.12,19.75 | 7.25,19.75 7.66,20.16 7.66,21.16 9.72,23.22 12.19,23.22 13.69,21.75 16.31,21.75 17.69,23.12 21.81,23.12 22.5,22.44 24.31,22.44 v24.56,22.69
  Bottom 0.254: U$10.6 v3.25,18.75
AD3  (via drill 0.23, 0.3)
  Top 0.254: v0.62,19.25 U$10.5 | v27.94,13.56 27.94,14.51 U1.26
  Route2 0.2: 0.88,23.25 1.88,24.25 4.88,24.25 7.12,26.5 | 0.75,19.38 v0.62,19.25
  Route2 0.254: 0.88,23.25 0.88,21.81 1.19,21.5 1.19,20 0.75,19.56 0.75,19.38 | 7.12,26.5 11.94,26.5 13.25,27.81 16.5,27.81 16.81,27.5 19,27.5 19.31,27.81 24.38,27.81 24.69,27.5 24.69,25.69 25.12,25.25 25.69,25.25 25.88,25.44 26.38,25.44 26.81,25 26.81,24.69 28.25,23.25 28.25,15.94 27.94,15.62 v27.94,13.56
  Bottom 0.254: U$10.5 v0.62,19.25
AD4  (via drill 0.23, 0.3)
  Top 0.254: U$10.4 v3.28,19.75 | U1.29 26.62,16 25.88,16.75 25.88,19.19 25.19,19.88 25.19,21.12 25.25,21.19 25.25,22.88 v25.31,22.94
  Route2 0.16: 3.69,20.25 4.62,20.25
  Route2 0.2: v3.28,19.75 3.28,19.84 3.69,20.25
  Route2 0.254: 4.62,20.25 5.44,20.25 6,20.81 6.47,20.81 9.31,23.66 12.47,23.66 13.94,22.19 16.12,22.19 17.5,23.56 22,23.56 22.69,22.88 23.25,22.88 23.62,23.25 25,23.25 v25.31,22.94
  Bottom 0.254: v3.28,19.75 U$10.4
AD5  (via drill 0.26, 0.3)
  Top 0.254: v0.62,21.25 U$11.1 | U1.30 26.8,16.51 26.31,17 26.31,19.38 25.62,20.06 25.62,20.94 25.69,21 25.69,22.5 25.88,22.69 25.88,23.44 26.06,23.62 26.06,24.12 25.19,25 25.19,25.62 v25.38,25.81
  Route2 0.2: 0.44,23.5 1.56,24.62 4.62,24.62 6.94,26.94 | 0.44,21.31 v0.62,21.25
  Route2 0.254: 0.44,21.31 0.44,23.5 | 6.94,26.94 11.62,26.94 12.94,28.25 16.69,28.25 17,27.94 18.81,27.94 19.12,28.25 24.69,28.25 25.12,27.81 25.12,26.06 v25.38,25.81
  Bottom 0.254: U$11.1 v0.62,21.25
AD_REF  (via drill 0.23, 0.3)
  Top 0.254: U$10.2 v3.28,20.75 | U1.21 24.5,15.56 24.12,15.94 24.12,18.44 23.31,19.25 23.06,19.25 22.75,19.56 22.75,20.12 22.81,20.19 22.81,23.31 v22.94,23.44
  Route2 0.254: v3.28,20.75 3.28,20.97 3.62,21.31 4.81,21.31 4.88,21.25 6.28,21.25 9.12,24.09 12.72,24.09 14.19,22.62 15.94,22.62 17.31,24 22.38,24 v22.94,23.44
  Bottom 0.254: v3.28,20.75 U$10.2
BOOT1
  Top 0.254: U1.37 29.88,19.99 29.88,20.12
  Top 0.406: R10.2 29.88,20.12 | 29.88,19.99 R9.1
CAN1_RX  (via drill 0.3)
  Top 0.254: U1.81 14.56,24 15.19,23.38 15.19,21.94 16.62,20.5 16.62,19.38 v16.69,19.31
  Route2 0.254: v16.69,19.31 v14,19.31
  Bottom 0.254: IC1.4 13.78,20.03
  Bottom 0.406: 13.78,20.03 13.56,19.82 13.56,19.69 13.94,19.31 v14,19.31
CAN1_TX  (via drill 0.3)
  Top 0.254: U1.82 14.25,23.5 v14.56,23.19
  Bottom 0.254: 13.63,23.81 IC1.1 14.03,23.84 14.03,23.72 v14.56,23.19
  Bottom 0.406: 13.63,23.81 13.56,23.88
CAN_H  (via drill 0.23, 0.3)
  Top 0.254: v0.62,14.25 U$11.15
  Route2 0.16: 2.88,12.25 4.56,12.25 | 6.44,11.75 7.25,11.75 7.44,11.56 v8.06,11.56
  Route2 0.254: 2.88,12.25 2.56,12.25 2,12.81 2,13.69 1.44,14.25 v0.62,14.25 | 4.56,12.25 5.62,12.25 6.19,11.75 6.44,11.75
  Bottom 0.254: U$11.15 v0.62,14.25 | v8.06,11.56 8.25,11.75 8.62,11.75 10.31,13.44 11.81,13.44 12.5,12.75 13.19,12.75 13.81,13.38 15.22,13.38 15.81,13.97 15.81,16.31 15.56,16.56 15.56,18.38 15.12,18.81 14.47,18.81 14.34,18.69 11.62,18.69 11,19.31 11,20.06 9.59,21.47 9.59,22.09 9.12,22.57 IC1.7
CAN_L  (via drill 0.23, 0.3)
  Top 0.254: U$11.16 v3.25,13.75
  Route2 0.16: 6.38,12.75 v8.19,12.75 | 4.69,13.25 3.75,13.25 v3.25,13.75
  Route2 0.254: 6.38,12.75 5.81,12.75 5.31,13.25 4.69,13.25
  Bottom 0.254: U$11.16 v3.25,13.75 | v8.19,12.75 9.75,14.31 12.81,14.31 13.31,13.81 14.97,13.81 15.38,14.22 15.38,15.31 14.56,16.12 14.56,17.69 14.22,18.03 11.53,18.03 10.56,19 10.56,19.88 9.13,21.3 IC1.6
DEBUG_UART_RX  (via drill 0.3)
  Top 0.254: U1.69 17.5,29.18 v17.5,29.38
  Top 0.305: U$4.7 18.5,5.88 18.25,6.12 17.75,6.12 17.25,6.62 15.56,6.62 14.5,7.69 13.56,7.69 12.06,9.19 v12.06,9.31
  Route2 0.254: 17.5,29.19 17.88,28.81 18.44,28.81 18.75,29.12 25.19,29.12 26.06,28.25 26.06,28 28,26.06 28,24.75 29.12,23.62 29.12,13 28.5,12.38 27.88,12.38 27.44,11.94 24.44,11.94 21.19,8.69
  Route2 0.305: v12.06,9.31 12.06,8.94 12.31,8.69 21.19,8.69 | 17.5,29.19 v17.5,29.38
DEBUG_UART_TX  (via drill 0.3)
  Top 0.254: U1.68 18.01,29.07 v18.25,29.44
  Top 0.305: U$4.8 19.81,4.98 19.81,6.25 19.31,6.75 17.81,6.75 17.44,7.12 15.75,7.12 14.69,8.19 13.94,8.19 v12.81,9.31
  Route2 0.254: v18.25,29.44 18.44,29.56 27.25,29.56 28.31,28.44 28.31,26.5 28.44,26.38 28.44,24.94 29.56,23.81 29.56,10.62 28.94,10 23.31,10 21.31,8
  Route2 0.305: v12.81,9.31 12.81,9.56 12.44,9.94 11.81,9.94 11.44,9.56 11.44,8.75 12.19,8 21.31,8
GND  (via drill 0.23, 0.26, 0.3, 0.4, 0.5, 0.6, 0.8, 0.9)
  Top 0.2: U$10.25 0.75,9.25
  Top 0.254: U$11.3 v0.62,20.25 | v3.25,12.75 U$10.18 | U$10.19 v0.62,12.25 | U$10.23 0.75,10.25 0.75,10.06 | U$10.24 0.75,9.75 | U1.99 arc90 12.77,15 11.38,15 10.69,14.31 9.88,14.31 9.59,14.03 C3.2 9.59,13.28 10.06,12.81 v10.62,12.81 | 15,28.23 U1.74 14.99,29.04 14.78,29.25 14,29.25 13.62,29.62 13.62,29.88 C22.2 | C20.2 18.02,9.86 U$7.4 19,9.9 19,11.38 U1.10 19,13.87 18.06,14.81 v18.06,15.44 | U$7.2 21.24,8.34 C21.2 | R6.1 10.03,18.81 | U1.20 24,13.69 24,14 23.94,14.06 v23.81,14.06 | U1.27 29.1,14.99 C5.2
  Top 0.305: 10.03,18.81 9.94,18.91 v9.94,19.38 | 10.38,9.5 10.44,9.56 v10.44,10.31
  Top 0.406: v0.88,8.38 0.75,8.5 0.75,9.25 0.75,9.75 0.75,10.06 | C7.2 15.77,8.62 16.25,8.62 16.44,8.81 16.44,10.19 17.56,11.31 18.94,11.31 19,11.38 | C26.1 C24.2 C2.2 26.12,9.56 26.75,9.56 | v29.62,27.94 29.88,27.69 C25.2 | R10.1 v29.88,24.94 | U$4.3 13.47,5.47 10.38,8.56 10.38,9.5
  Top 0.61: C22.2 8.44,29.88 v7.94,29.38 7.95,29.37 C6.2 | C10.2 29.3,28.24 v29.62,27.94 | 26.75,9.56 28,9.56 28.19,9.75 28.19,11 v28.44,11.25 29.88,12.69 C5.2
  Bottom 0.2: U$10.25 0.75,9.25 0.75,9.31
  Bottom 0.254: U2.2 20.75,2.5 20.25,2 20.25,1.25 19.75,0.88 10.75,0.88 10.5,1 9.5,1 8.75,1.75 8.75,5.5 9.75,6.5 R8.1 10.15,6.3 C15.2 | 13.64,22.54 IC1.2 | v0.62,20.25 U$11.3 | U$10.18 v3.25,12.75 | v0.62,12.25 U$10.19 | 0.75,9.75 0.69,9.75 | U$10.23 0.75,10.25 0.75,10.06 | U$10.24 0.75,9.75 | 0.75,9.75 0.75,8.88 | v9.94,19.38 9.81,19.47 9.81,20 9.12,20.69 7.25,20.69 6.88,21.06 R134.2
  Bottom 0.406: v0.88,8.38 0.75,8.5 0.75,8.88 0.75,9.31 0.75,10.06 | 18.4,15.4 v18.06,15.44 | TX.C 15.49,21.97 | 25.44,28.19 25.44,27.81 26.44,26.81 v26.44,26.12
  Bottom 0.61: IC1.2 14.09,22.57 C14.1 15.49,21.97 | 4.C 9.47,27.56 3.C 2.C 9.5,29.69 1.C 8.28,29.72 v7.94,29.38 | C1.2 18.06,13.84 v18.06,15.44 | U$3.21 25.44,29.39 25.44,28.19 | 18.1,28.12 U$3.16 17.85,28.38 16.81,28.38 16.75,28.44 v16.75,29.44 | 29.62,29.35 v29.62,27.94
  Bottom 0.813: 16.25,6 D2.A | 19.82,15.58 19.68,15.44 v18.06,15.44 | 15.71,23.35 RX.C | v15.62,24 15.71,23.91 15.71,23.35 | TX.C 15.71,22.19 15.71,23.35 | U$3.23 U$3.24 29.62,29.35
  Bottom 1.016: U$3.8 19.82,15.58 C9.2 | U$8.2 28.25,11.44 v28.44,11.25
  other vias: 9.75,5.62
  pour Route15: 0.06,30.44 0.06,0.06 30.41,0.06 30.41,30.44
  pour Bottom: 9.19,6.88 9.62,7.31 17.38,7.31 18.12,6.56 18.12,3.5 17.44,2.81 11.06,2.81 9.12,4.75 9.12,6.88
  pour Top: 22.44,10.56 17.38,10.56 16.75,9.94 16.75,8.12 17.56,7.31 22.31,7.31 23,8 23,10
I2C_SCL  (via drill 0.26, 0.3)
  Top 0.254: U$11.17 v0.62,13.25 | U1.47 27.43,25 26.25,25 v26.12,24.88
  Route2 0.16: 3.56,11.25 4.69,11.25
  Route2 0.254: 3.56,11.25 2.62,11.25 v0.62,13.25 | 4.69,11.25 5.19,11.25 6.56,9.88 9,9.88 10,10.88 12.88,10.88 13.88,9.88 21.06,9.88 24.62,13.44 24.62,13.81 27.81,16.94 27.81,23.06 26.12,24.75 v26.12,24.88
  Bottom 0.254: U$11.17 v0.62,13.25
I2C_SDA  (via drill 0.23, 0.3)
  Top 0.254: U$11.35 v4.12,13.75 | v27,25.62 27.12,25.5 U1.48
  Route2 0.254: v9.12,15.81 13.25,15.81 13.69,15.38 14.12,15.38 14.53,15.78 16.84,15.78 17.5,16.44 18.69,16.44 20.31,18.06 v20.31,18.69
  Bottom 0.2: U$11.35 7.06,13.75
  Bottom 0.254: U$11.35 v4.12,13.75 | 7.06,13.75 v9.12,15.81 | v20.31,18.69 21.25,18.69 21.81,19.25 23.56,19.25 24.06,19.75 27,19.75 27.81,20.56 27.81,24.81 v27,25.62
JTCK  (via drill 0.3)
  Top 0.254: R2.1 10.75,26.53 11.91,26.53 11.94,26.53 11.94,26.5 U1.76
  Top 0.305: 12.19,4.95 12.19,5.81 9.81,8.19 v9.81,9.88 | v11.88,28.12 11.88,26.56 11.91,26.53
  Top 0.406: U$4.2 12.19,4.95
  Route2 0.254: v11.88,28.12 12.88,29.12 14.38,29.12 15.25,30 27.88,30 28.75,29.12 28.75,27.44 28.88,27.31 28.88,25.12 30,24 30,10.06 29.44,9.5 24.06,9.5 21.44,6.88
  Route2 0.305: v9.81,9.88 9.81,8.75 11.69,6.88 21.44,6.88
JTMS  (via drill 0.3)
  Top 0.254: v16,29.41 16,29.38 U1.72
  Top 0.305: U$4.4 14.75,4.96 14.75,6 14.06,6.69 13.06,6.69 10.94,8.81 10.94,9.88 11.25,10.19 v11.25,10.31 11.25,10.71 R3.1
  Route2 0.254: v16,29.41 16,29.31 16.56,28.75 16.81,28.75 17.19,28.38 18.62,28.38 18.94,28.69 24.88,28.69 25.62,28 25.62,27.81 27.56,25.88 27.56,24.56 28.69,23.44 28.69,13.25 28.31,12.88 27.69,12.88 27.25,12.44 24.25,12.44 21.06,9.25
  Route2 0.305: v11.25,10.31 11.38,10.44 12.62,10.44 13.81,9.25 21.06,9.25
LED_BLAU  (via drill 0.3)
  Top 0.254: v20.8,26.44 20.81,27 21.01,27.2 U1.62
  Route2 0.254: v15.81,26.31 15.94,26.19 20.56,26.19 20.75,26.38 v20.8,26.44
  Bottom 0.254: R12.2 13.97,29.69
  Bottom 0.305: 13.97,29.69 14.44,29.69 15.81,28.31 v15.81,26.31
LED_GELB  (via drill 0.3)
  Top 0.254: U1.60 22,27.38 22,27.25 22.06,27.19 22.06,26.25 v22,26.25
  Route2 0.254: v14.56,25.5 14.75,25.31 21.12,25.31 22,26.19 v22,26.25
  Bottom 0.305: R15.2 14,27.56 14.31,27.56 14.56,27.31 v14.56,25.5
LED_GRUEN  (via drill 0.3)
  Top 0.254: v22.62,25.88 22.56,25.94 22.56,26.56 22.51,26.62 U1.59
  Route2 0.254: v14,25.06 14.19,24.88 21.31,24.88 22.12,25.69 22.44,25.69 v22.62,25.88
  Bottom 0.254: R14.2 13.88,26.53
  Bottom 0.305: v14,25.06 13.88,25.19 13.88,26.53
LED_ROT  (via drill 0.3)
  Top 0.254: v21.44,26.81 21.49,26.93 U1.61
  Route2 0.254: v15.19,25.94 15.38,25.75 20.94,25.75 21.44,26.25 v21.44,26.81
  Bottom 0.254: R13.2 14,28.62
  Bottom 0.305: 14,28.62 14.44,28.62 15.19,27.88 v15.19,25.94
N$1
  Top 0.254: 14.94,29.88 C22.1 14.88,29.75 15.44,29.19 15.44,29 15.5,28.94 U1.73
N$2
  Bottom 0.406: U$3.15 17.05,26.91 R112.2
N$5
  Bottom 0.254: U2.3 21.6,1.5 21,1.5 20.75,1.25 20.75,1.12 20,0.44 9.25,0.44 8.25,1.5 8.25,6.38 8.53,6.38 R7.1 9.25,7.09 9.25,7.62 9.66,8.03 R8.2 9.91,8.03
N$7
  Bottom 0.61: U2.1 21.65,4.2 C17.1 22,5.15 D1.C
N$8
  Bottom 0.254: C17.2 19,4.5
  Bottom 0.61: U2.6 18.85,4.35 19,4.5
  Bottom 0.813: 19,4.5 19,5.2 D2.C
  Bottom 1.016: 19,8.25 18.85,8.4 L1.1
  Bottom 1.27: D2.C 20.05,7.2 19,8.25
N$9
  Bottom 0.406: 1.A R12.1
N$11
  Bottom 0.406: 2.A 10.94,28.81 12.19,28.81 12.31,28.69 R13.1
N$13
  Bottom 0.406: 4.A 10.81,26.59 R14.1
N$14
  Top 0.254: 11.38,17.5 U1.94
  Top 0.406: R1.1 R6.2 10.22,17.5 11.38,17.5
N$15
  Bottom 0.406: 3.A 10.97,27.44 12.25,27.44 12.44,27.62 R15.1
N$40
  Top 0.254: U1.49 29.58,26.01 C25.1
N$46
  Bottom 0.305: IC1.8 8.18,23.81 7.19,23.81 6.88,23.5 R134.1
N$80
  Bottom 0.406: RX.A 16.57,24.89 R112.1
N$89
  Bottom 0.406: TX.A 15.85,20.83 R120.1
N$94
  Bottom 0.406: R120.2 17.31,22.7 U$3.12
N$97
  Bottom 0.254: R50.2 11.75,4.65 11.75,4 12.1,3.65 U$9.1 13.02,3.45 R83.1
NRST
  Top 0.254: 21.01,11.74 U1.14 | C26.2 R11.1 23.21,9.59 23.19,9.56
  Top 0.305: U$4.5 15.97,3.59 16.25,3.31 20.12,3.31 20.94,4.12 20.94,6 21.75,6.81 22.81,6.81 23.19,7.19 23.19,9.56 23.19,10.5 22.25,11.44 21.31,11.44 21.01,11.74
P0  (via drill 0.23)
  Top 0.254: U$10.50 v6.06,21.81 6.09,21.84 6.09,23 9.19,26.09 11.44,26.09 12.03,25.5 U1.78
  Bottom 0.254: v6.06,21.81 U$10.50
P1  (via drill 0.23)
  Top 0.2: U$10.49 6.31,20.75
  Top 0.254: v4.12,20.75 U$10.49 | 6.31,20.75 6.44,20.75 6.75,21.06 6.75,23.06 9.34,25.66 11.28,25.66 11.94,25 U1.79
  Bottom 0.254: U$10.49 v4.12,20.75
P2  (via drill 0.23)
  Top 0.254: U$10.48 v6.81,20.25 | v6.81,20.25 7.06,20.5 | U1.80 11.76,24.49 11.03,25.22 9.56,25.22 7.25,22.91 7.25,20.69 v6.81,20.25
  Bottom 0.254: v6.81,20.25 U$10.48
P3  (via drill 0.23)
  Top 0.16: 7.19,19.75 U$10.47
  Top 0.254: U$10.47 v4.12,19.75 | 7.19,19.75 7.31,19.75 7.88,20.31 9.84,20.31 11.66,18.49 U1.92
  Bottom 0.254: U$10.47 v4.12,19.75
P4  (via drill 0.23)
  Top 0.2: v6.81,19.25 7.5,19.25 8.03,18.72 8.03,18.22 8.19,18.06 10.62,18.06 10.68,18.01 U1.93
  Top 0.254: U$10.46 v6.81,19.25
  Bottom 0.254: v6.81,19.25 U$10.46
P5  (via drill 0.23)
  Top 0.16: 7,18.75 U$10.45
  Top 0.2: 8.06,16.81 7.78,17.09 7.78,17.97 7.53,18.22 7.53,18.53 7.31,18.75 7,18.75
  Top 0.254: U$10.45 v4.12,18.75 | 8.06,16.81 10.62,16.81 10.68,16.87 11.75,16.88 11.87,17 U1.95
  Bottom 0.254: U$10.45 v4.12,18.75
P6  (via drill 0.23)
  Top 0.254: U$10.44 v6.81,18.25 7.34,17.72 7.34,16.91 7.88,16.38 10.75,16.38 10.81,16.44 11.94,16.44 12,16.5 12.77,16.5 U1.96
  Bottom 0.254: v6.81,18.25 U$10.44
P7  (via drill 0.23, 0.3)
  Top 0.254: U$10.43 v4.12,17.75 | U1.67 18.49,20.13 v19.12,19.44
  Route2 0.254: v19.12,19.44 18.75,19.44 18.19,18.88 18.19,18.56 17.38,17.75 16.81,17.75 16.31,17.25 14.62,17.25 14.41,17.47 v13.97,17.47
  Bottom 0.2: U$10.43 7.38,17.75
  Bottom 0.254: U$10.43 v4.12,17.75 | 7.38,17.75 9.94,17.75 10.22,17.47 v13.97,17.47
P8  (via drill 0.23, 0.3)
  Top 0.254: U$10.37 v4.12,14.75 | U1.63 20.5,27.31 20.25,27.06 20.25,26.38 20,26.12 20,21.38 20.62,20.75 v20.62,20.12
  Route2 0.254: v13.97,16.03 14.16,16.22 16.59,16.22 17.25,16.88 18.38,16.88 19.69,18.19 19.69,19.06 20.06,19.44 20.06,19.81 20.38,20.12 v20.62,20.12
  Bottom 0.2: 7.25,14.75 6.38,14.75
  Bottom 0.254: v4.12,14.75 U$10.37 6.38,14.75 | 7.25,14.75 8.88,16.38 9.56,16.38 9.91,16.03 v13.97,16.03
P9  (via drill 0.23)
  Top 0.254: U$10.36 v6.81,14.25 7.31,14.75 10.44,14.75 11.18,15.5 U1.98
  Bottom 0.254: U$10.36 v6.81,14.25
PH0
  Top 0.254: C20.1 17.77,8.26 U$7.1 19.07,8.38 19.81,8.38 20.06,8.62 20.06,10.88 19.99,10.95 U1.12
PH1
  Top 0.254: U1.13 20.5,11.25 21.16,10.59 U$7.3 21.49,9.53 C21.1
PWM0  (via drill 0.23, 0.3)
  Top 0.254: U$10.40 v6.81,16.25 | U1.40 27.29,21.49 27.06,21.25 26.38,21.25 v26.25,21.12
  Route2 0.254: v6.81,16.25 8.12,16.25 8.69,16.81 11.38,16.81 13.31,18.75 14.41,18.75 14.53,18.88 15.19,18.88 15.31,18.75 16.94,18.75 17.31,19.12 17.31,19.62 18.62,20.94 19.69,20.94 19.94,20.69 22.44,20.69 22.56,20.81 24.69,20.81 25,21.12 v26.25,21.12
  Bottom 0.254: v6.81,16.25 U$10.40
PWM1  (via drill 0.23, 0.3)
  Top 0.2: U$10.41 4.75,16.75
  Top 0.254: v4.12,16.75 U$10.41 | U1.42 27.44,22.51 26.94,21.94 v26.81,21.81
  Route2 0.16: 6.44,16.75 7.19,16.75
  Route2 0.254: v4.12,16.75 6.44,16.75 | 7.19,16.75 8,16.75 8.5,17.25 11,17.25 13.75,20 17.06,20 18.44,21.38 19.88,21.38 20.12,21.12 22.12,21.12 22.25,21.25 24.38,21.25 24.81,21.69 26.69,21.69 v26.81,21.81
  Bottom 0.254: U$10.41 v4.12,16.75
PWM2  (via drill 0.23, 0.3)
  Top 0.254: U$10.39 v4.12,15.75 | U1.44 27.43,23.5 27.19,23.25 27.19,22.88 26.69,22.38 26.38,22.38 v26.25,22.25
  Route2 0.254: v19.12,18.69 17.75,17.31 17,17.31 16.44,16.75 v13.97,16.75
  Bottom 0.2: 6.44,15.75 7.12,15.75
  Bottom 0.254: v4.12,15.75 U$10.39 6.44,15.75 | 7.12,15.75 7.19,15.75 8.31,16.88 9.91,16.88 10.03,16.75 v13.97,16.75 | v19.12,18.69 19.25,18.69 20.06,19.5 20.06,20.5 20.31,20.75 24.94,20.75 25.75,21.56 25.75,21.94 26.06,22.25 v26.25,22.25
PWM3  (via drill 0.23, 0.3)
  Top 0.254: U$10.42 v6.81,17.25 | U1.45 27.13,24 26.69,23.56 26.69,23.25 v26.44,23
  Route2 0.254: v6.81,17.25 7.88,17.25 8.31,17.69 10.75,17.69 13.5,20.44 16.88,20.44 18.25,21.81 20.12,21.81 20.38,21.56 21.69,21.56 v21.81,21.69
  Bottom 0.254: v6.81,17.25 U$10.42 | v21.81,21.69 22.06,21.69 22.56,21.19 24.75,21.19 25.31,21.75 25.31,22.12 26.19,23 v26.44,23
SPI0_CS0  (via drill 0.25, 0.3)
  Top 0.254: v0.62,15.25 U$10.13 | v26.19,20.31 26.75,19.75 26.75,17.44 27.19,17 U1.31
  Route2 0.16: 2.81,14.25 4.62,14.25 | 6.44,13.75 7.25,13.75
  Route2 0.254: 2.81,14.25 2.5,14.25 1.5,15.25 v0.62,15.25 | 4.62,14.25 5.12,13.75 6.44,13.75 | 7.25,13.75 11.5,13.75 12.56,12.69 14.5,12.69 15.5,11.69 19.75,11.69 20.81,12.75 20.81,16.5 21.75,17.44 21.75,19.19 21.94,19.38 22.44,19.38 22.75,19.69 22.75,20.12 23,20.38 23.5,20.38 23.56,20.31 v26.19,20.31
  Bottom 0.254: U$10.13 v0.62,15.25
SPI0_CS1  (via drill 0.23, 0.3)
  Top 0.254: v3.25,14.75 U$10.14 | U1.66 19,27.06 18.94,27 18.94,26.38 19.06,26.25 19.06,21.62 20.06,20.62 20.06,19.81 20.5,19.38 v20.62,19.38
  Route2 0.16: 7.12,14.75 6.12,14.75 | 3.75,15.25 4.69,15.25
  Route2 0.2: v3.25,14.75 3.75,15.25
  Route2 0.254: 4.69,15.25 5.19,14.75 6.12,14.75 | 7.12,14.75 9.38,14.75 9.56,14.56 12.75,14.56 13.75,13.56 14.88,13.56 15.44,13 17.44,13 19.88,15.44 19.88,16.94 20.88,17.94 20.88,19.19 v20.62,19.38
  Bottom 0.254: U$10.14 v3.25,14.75
SPI0_CS2  (via drill 0.23, 0.3)
  Top 0.254: U$10.9 v0.62,17.25 | U1.64 20,27.44 19.75,27.19 19.75,26.75 v19.69,26.75
  Route2 0.2: 2.06,21.06 4.5,23.5 5.25,23.5 7.31,25.56 12.5,25.56
  Route2 0.254: 2.06,21.06 2.06,19.38 1.69,19 1.69,18.69 1.31,18.31 1.31,17.94 v0.62,17.25 | 12.5,25.56 13.81,26.88 16.19,26.88 16.44,26.62 19.62,26.62 v19.69,26.75
  Bottom 0.254: v0.62,17.25 U$10.9
SPI0_CS3  (via drill 0.23)
  Top 0.254: U$10.38 v6.81,15.25 6.88,15.19 10.19,15.19 11,16 U1.97
  Bottom 0.254: v6.81,15.25 U$10.38
SPI0_MISO  (via drill 0.23, 0.3)
  Top 0.254: v3.25,16.75 U$10.10 | U1.90 11.9,19.51 11.12,20.28 v11.12,20.78 11.12,20.62
  Route2 0.16: 3.75,17.25 4.62,17.25 | 6.44,17.75 7.12,17.75
  Route2 0.2: v3.25,16.75 3.75,17.25
  Route2 0.254: 4.62,17.25 5.12,17.75 6.44,17.75 | 7.12,17.75 7.75,17.75 8.12,18.12 10.25,18.12 11.12,19 v11.12,20.78
  Bottom 0.254: U$10.10 v3.25,16.75
SPI0_MOSI  (via drill 0.23, 0.3)
  Top 0.254: U$10.11 v0.62,16.25 | U1.91 11.81,19 9.44,21.38 9.44,24.25 v9.84,24.66
  Route2 0.2: 2.5,20.88 4.75,23.12 5.56,23.12
  Route2 0.254: 2.5,20.88 2.5,19.19 2.12,18.81 2.12,17.19 1.19,16.25 v0.62,16.25 | 5.56,23.12 7.09,24.66 v9.84,24.66
  Bottom 0.254: v0.62,16.25 U$10.11
SPI0_SCK/SWO  (via drill 0.23, 0.3)  (1 unrouted)
  Top 0.254: v3.25,15.75 U$11.12 | 14.56,20 U1.89 | U1.89 12,20 11.75,20.25 11.75,23.44 10.64,24.54 R4.2
  Top 0.305: U$4.6 17.25,4.96 17.25,5.88 17,6.12 15.31,6.12 14.25,7.19 13.31,7.19 11.44,9.06 11.44,9.62 14.06,12.25 14.06,15.28 15.12,16.34 15.12,18.25 | 14.56,20 15.12,19.44 15.12,18.25 | 15.12,18.25 v14.84,18.25
  Route2 0.16: 3.75,16.25 4.56,16.25 | 6.5,15.75 7.12,15.75
  Route2 0.2: v3.25,15.75 3.75,16.25 | 4.56,16.25 5.06,15.75 6.5,15.75
  Route2 0.254: 7.12,15.75 8.25,15.75 8.88,16.38 11.69,16.38 13.56,18.25 v14.84,18.25 17.12,18.25 17.75,18.88 17.75,19.31 18.69,20.25 v19.31,20.25
  Bottom 0.254: U$11.12 v3.25,15.75
SPI_CS_DWM1000  (via drill 0.3)
  Top 0.254: U1.39 27.41,21.01 27.09,20.69 v26.81,20.69
  Route2 0.254: v22.38,25.12 22.44,25.06 23.12,25.06 24.38,23.81 v24.56,23.81
  Bottom 0.254: U$3.17 19.82,27.88 19,27.06 19,26.31 19.75,25.56 19.75,24.5 20.44,23.81 21.88,23.81 22.38,24.31 v22.38,25.12 | v24.56,23.81 25.19,24.44 25.69,24.44 26.38,23.75 26.56,23.75 27.38,22.94 27.38,21.12 26.94,20.69 v26.81,20.69
SPI_MISO_DWM1000  (via drill 0.3)
  Top 0.254: U1.17 22.51,14.44 23.25,15.19 23.25,17.16 22.72,17.69 22.44,17.69 21.19,18.94 21.19,20.84 20.66,21.38 20.66,22.09 v20.69,22.12
  Bottom 0.254: v20.69,22.12 21.62,23.06 21.75,23.06 23.19,24.5 23.19,26.22 22.97,26.44 22.69,26.44 22.44,26.69 22.44,28.12 22.63,28.31 U$3.19
SPI_MOSI_DWM1000  (via drill 0.3)
  Top 0.254: U1.54 25,27.19 24.56,26.75 24.56,26.41 24.06,25.91 24.06,24.72 23.47,24.12 23.47,24.03 v23.44,23.94
  Route2 0.254: v23.44,23.94 22.81,24.56 v21.81,24.56
  Bottom 0.254: v21.81,24.56 20.25,26.12 20.25,27.03 21.23,28.01 U$3.18
SPI_SCK_DWM1000  (via drill 0.3)
  Top 0.254: U1.52 26.01,26.7 v25.75,26.44
  Bottom 0.254: v25.75,26.44 25.16,26.44 24.03,27.59 U$3.20
UART0_RX  (via drill 0.23, 0.3)
  Top 0.254: v6.81,13.25 U$11.34 | U1.87 14.87,21.01 15.69,20.19 15.69,15.78 15.03,15.12 v14.75,15.12
  Bottom 0.254: U$11.34 v6.81,13.25 7.25,13.25 9.19,15.19 14.75,15.19 v14.75,15.12
UART0_TX  (via drill 0.23, 0.3)
  Top 0.254: U$11.33 v4.12,12.75 | v14.66,14.41 15.19,14.41 16.12,15.34 16.12,20.38 15.01,21.49 U1.86
  Bottom 0.2: 6.31,12.75 7.31,12.75
  Bottom 0.254: v4.12,12.75 U$11.33 6.31,12.75 | 7.31,12.75 7.38,12.75 9.38,14.75 13.06,14.75 13.31,14.5 14.62,14.5 v14.66,14.41
UART1_CTS  (via drill 0.3)
  Top 0.254: U$10.29 6.5,10.75 6.62,10.62 7.25,10.62 v7.44,10.44 | U1.58 23,27.12 v23.12,27.06
  Route2 0.254: v7.44,10.44 7.56,10.56 8.56,10.56 9.31,11.31 13.12,11.31 14.06,10.38 20.94,10.38 23.06,12.5 23.06,14.25 23.56,14.75 24.94,14.75 27.38,17.19 27.38,22.88 26.69,23.56 26.5,23.56 25.25,24.81 24.75,24.81 23.81,25.75 23.81,26.38 v23.12,27.06
  Bottom 0.254: U$10.29 6.5,10.75 6.62,10.62 7.25,10.62 v7.44,10.44
UART1_RTS  (via drill 0.23, 0.3)
  Top 0.254: v6.81,11.25 U$10.30 | U1.53 25.5,27.07 25,26.56 25,26.25 24.5,25.75 24.5,24.56 24,24.06 24,23.62 23.25,22.88 23.25,19.88 v23.31,19.81
  Route2 0.254: v6.81,11.25 7.06,11 8.31,11 9.06,11.75 13.38,11.75 14.31,10.81 20.19,10.81 21.81,12.44 21.81,13.62 24.62,16.44 24.62,19.44 24.12,19.81 v23.31,19.81
  Bottom 0.254: U$10.30 v6.81,11.25
UART1_RX  (via drill 0.23, 0.3)
  Top 0.254: v6.81,12.25 U$10.32 | U1.56 24,27.44 23.69,27.12 23.69,26.81 23.19,26.31 23.19,25.12 21.25,23.19 21.25,21.38 21.62,21 21.62,19.69 22.31,19 v22.31,18.69
  Route2 0.254: v6.81,12.25 7.31,12.25 7.38,12.19 13.62,12.19 14.56,11.25 19.94,11.25 21.31,12.62 21.31,16.31 22.31,17.31 v22.31,18.69
  Bottom 0.254: U$10.32 v6.81,12.25
UART1_TX  (via drill 0.23, 0.3)
  Top 0.254: U$10.31 v4.12,11.75 | U1.55 24.49,27.3 24.12,26.94 24.12,26.62 23.62,26.12 23.62,24.94 22.38,23.69 22.38,20.56 22.19,20.38 v22.19,19.94
  Route2 0.254: v12.81,13.31 13,13.12 14.69,13.12 15.25,12.56 19.25,12.56 20.31,13.62 20.31,16.69 21.31,17.69 21.31,19.38 21.88,19.94 v22.19,19.94
  Bottom 0.2: 7.06,11.75 6.31,11.75
  Bottom 0.254: U$10.31 v4.12,11.75 6.31,11.75 | 7.06,11.75 7.5,12.19 8.44,12.19 10.12,13.88 12.25,13.88 v12.81,13.31
UWB_INT  (via drill 0.3)
  Top 0.254: v23.06,18.69 23.69,18.06 23.69,15 23,14.31 U1.18
  Bottom 0.254: v23.06,18.69 23.62,18.69 24.25,19.31
  Bottom 0.305: 24.25,19.31 27.19,19.31 28.25,20.38 28.25,25.81 26.56,27.5 26.56,29.15 U$3.22
UWB_RESET  (via drill 0.3)
  Top 0.254: U1.7 17.5,13.94 16.56,14.88 16.56,16.38 17.25,17.06 21.69,17.06 22.5,16.25 v22.69,16.25
  Bottom 0.254: 26.81,17.46 U$3.3 26.75,17.38 26.75,16.5 26.44,16.19 22.75,16.19 v22.69,16.25
UWB_WAKEUP  (via drill 0.3)
  Top 0.254: U1.8 18.01,14.05 17,15.06 17,16.12 17.44,16.56 21.31,16.56 22.38,15.5 v22.69,15.5
  Bottom 0.254: U$3.2 28.25,17.43 28.25,16.62 27.38,15.75 23,15.75 22.75,15.5 v22.69,15.5
V+  (via drill 0.8, 0.9)
  Top 0.305: U$11.28 6.25,10.25 7,10 7,9.31 6.56,9.75 U$11.27 | U$11.26 7.06,9.25 v7,7.62
  Top 1.016: v7,7.62 7,9.31
  Route2 1.016: v7,7.62 7,5.31 8.31,4 v9.75,4 10.38,3.38 21.12,3.38 24.44,6.69 v24.44,8.25
  Bottom 0.305: U$11.28 6.25,10.25 7,10 7,9.31 6.62,9.69 6.62,9.75 U$11.27 | U$11.26 7.06,9.25 7,7.69
  Bottom 0.61: v9.75,4 9.75,2.65 U$9.3
  Bottom 1.016: v7,7.62 7,7.69 7,9.31 | U$8.1 24.62,12.69 23.94,12 23.94,8.75 v24.44,8.25

### Text on the board
tNames: SKITH / TW / 7/2018 | Rx Tx
bNames: - +